# Altium schematic sheet Top.SchDoc
size A3
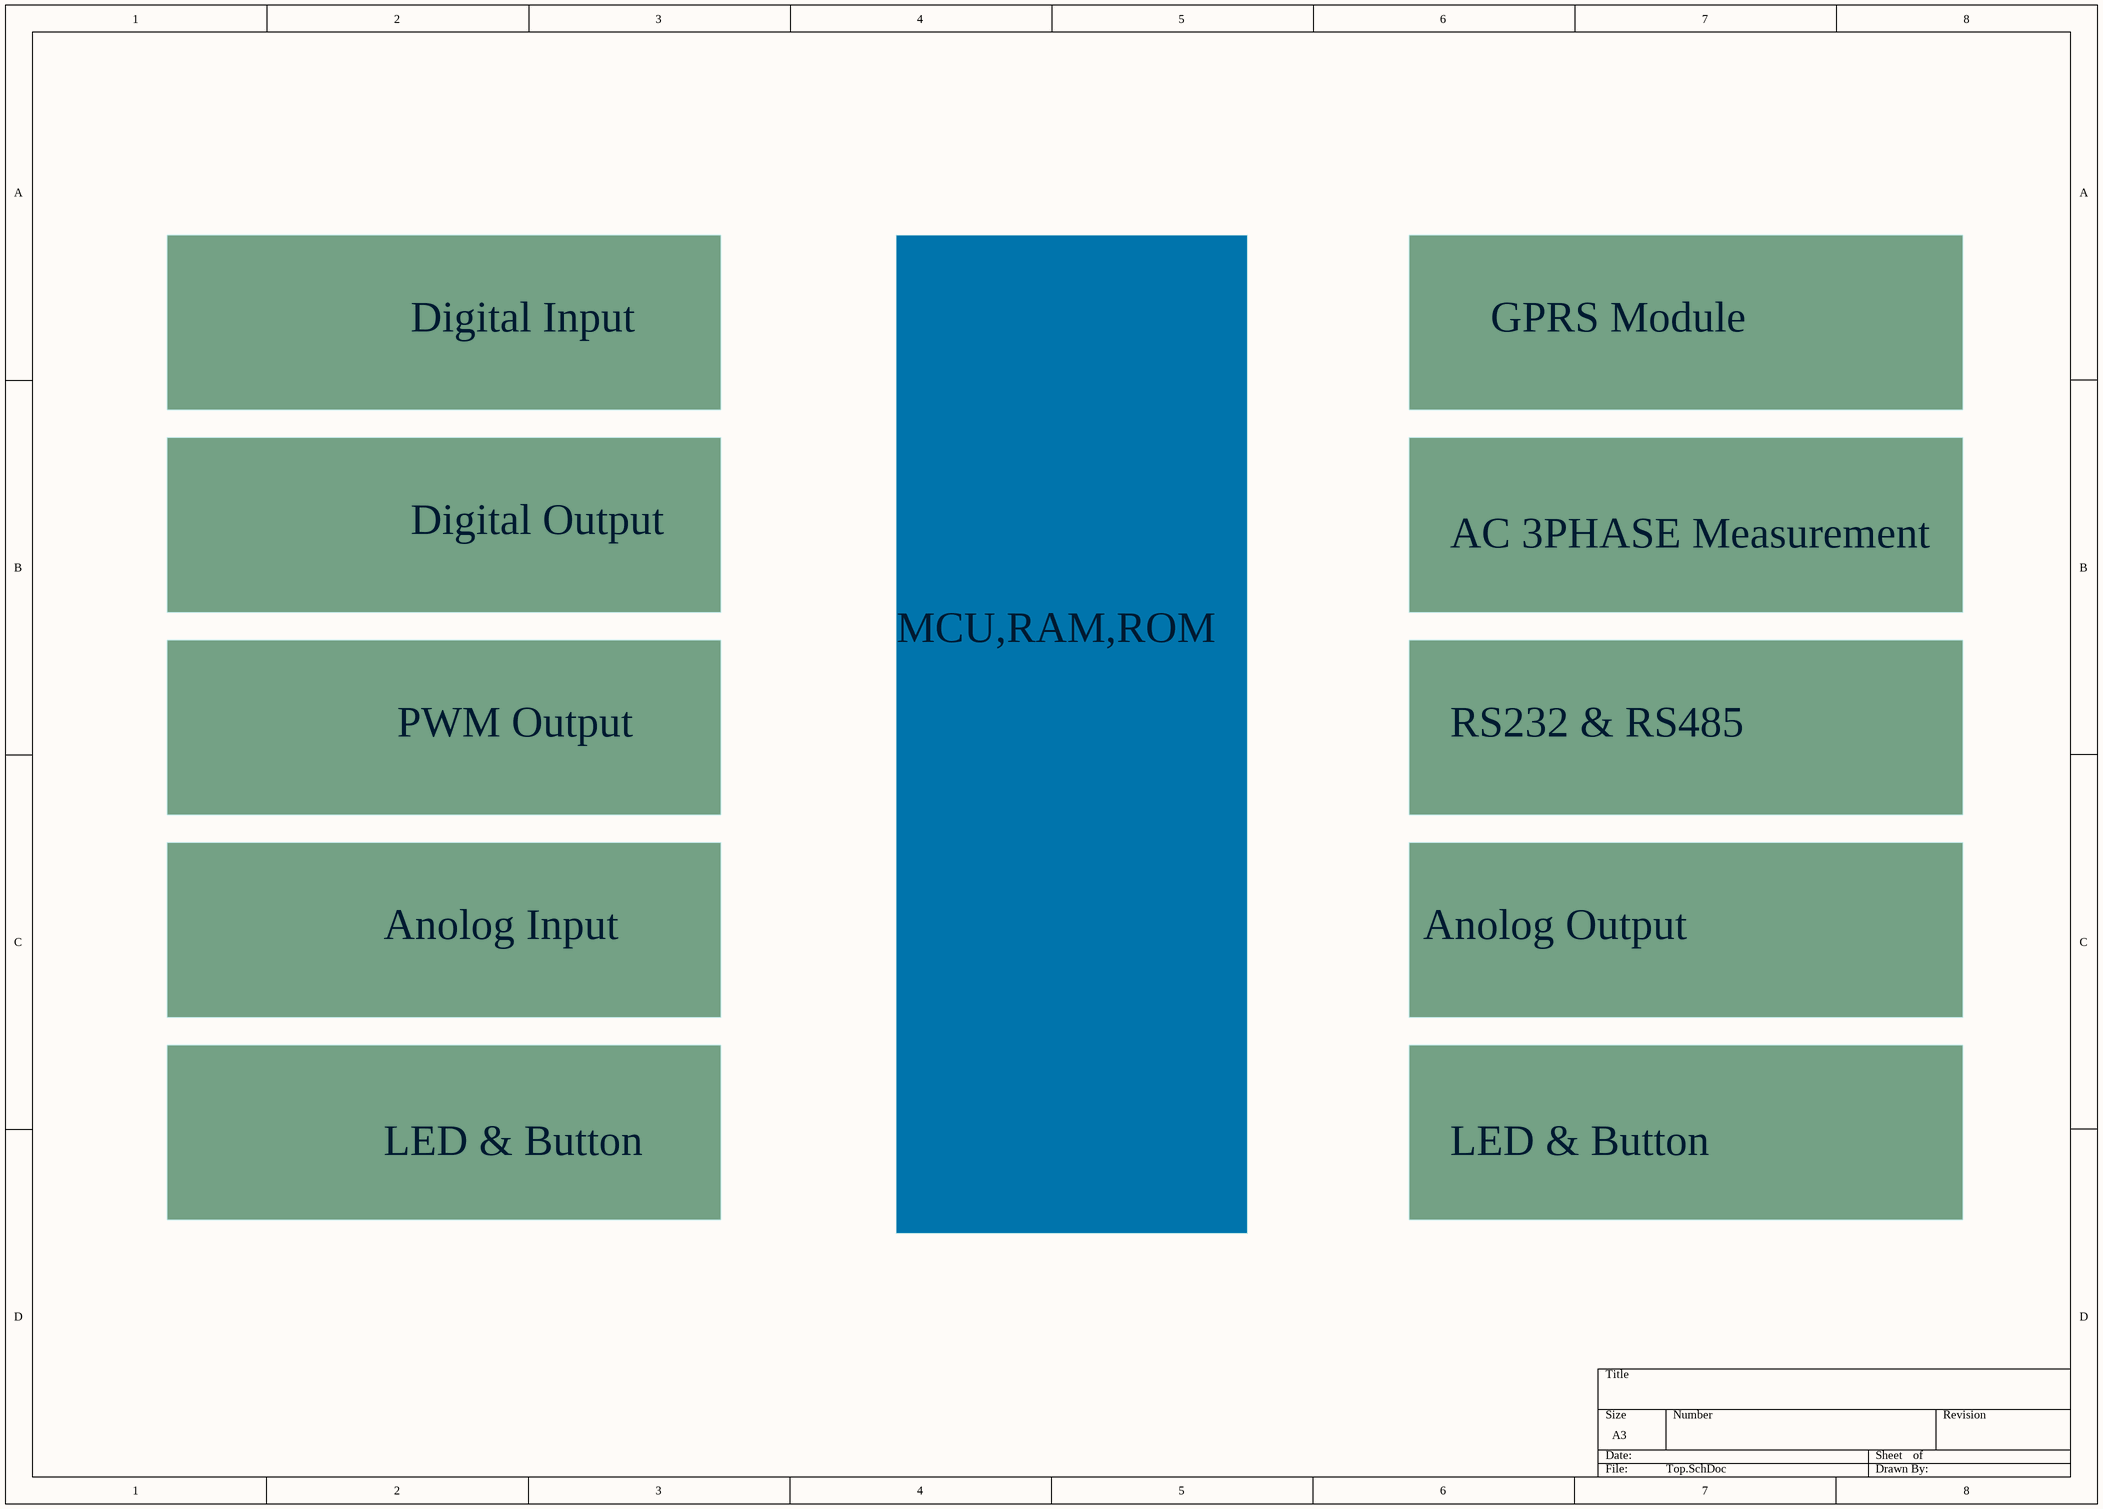
[diagram p0: Top.SchDoc]

## Sub-sheets
AC 3PHASE Measurement = ?: no entries
Anolog Input = ?: no entries
Anolog Output = ?: no entries
Digital Input = ?: no entries
Digital Output = ?: no entries
GPRS Module = ?: no entries
LED & Button = ?: no entries
LED & Button = ?: no entries
MCU,RAM,ROM = ?: no entries
PWM Output = ?: no entries
RS232 & RS485 = ?: no entries